# EAGLE design motor (EAGLE 8.7.0)
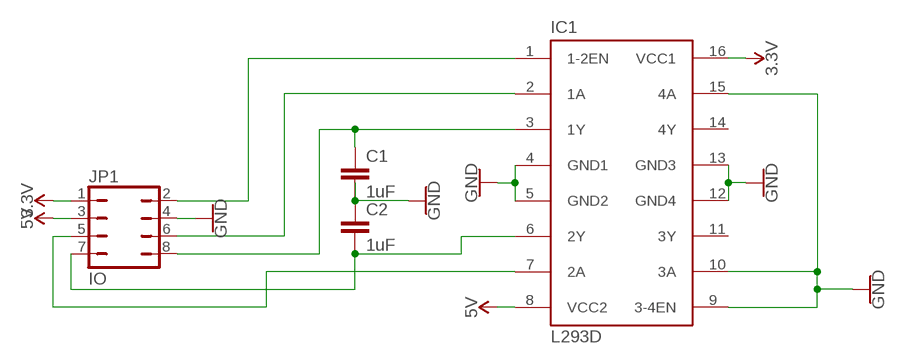
[diagram p0: schematic, sheet 1]

## Parts
C1  1uF  0.1UF-KIT-EZ-50V-20%  [CAP-PTH-SMALL-KIT]
C2  1uF  0.1UF-KIT-EZ-50V-20%  [CAP-PTH-SMALL-KIT]
IC1  L293D  [DIL16]
JP1  IO  JP4Q  [JP4Q]

## Nets
3.3V: IC1.16(VCC1) JP1.1
5V: IC1.8(VCC2) JP1.3
GND: C1.2 C2.1 IC1.4(GND1) IC1.5(GND2) IC1.9(3-4EN) IC1.10(3A) IC1.12(GND4) IC1.13(GND3) IC1.15(4A) JP1.4
N$1: C1.1 IC1.3(1Y) JP1.8
N$2: C2.2 IC1.6(2Y) JP1.7
N$4: IC1.1(1-2EN) JP1.2
N$5: IC1.2(1A) JP1.6
N$6: IC1.7(2A) JP1.5
Unconnected: IC1.11(3Y) IC1.14(4Y)

## Library data of the parts
C1 C2 = SparkFun-Capacitors:0.1UF: 0.1µF ceramic capacitors A capacitor is a passive two-terminal electrical component used to store electrical energy temporarily in an electric field.; PROD_ID: CAP-08370; VALUE: 0.1uF
IC1 = st-microelectronics:L293D: PUSH-PULL 4 CHANNEL DRIVER; MPN: L293D; OC_FARNELL: 9589619; OC_NEWARK: 56P8249
JP1 = jumper:JP4Q: JUMPER

## Net classes
0 default: width 0.635 mm, clearance 0.205 mm

## Board
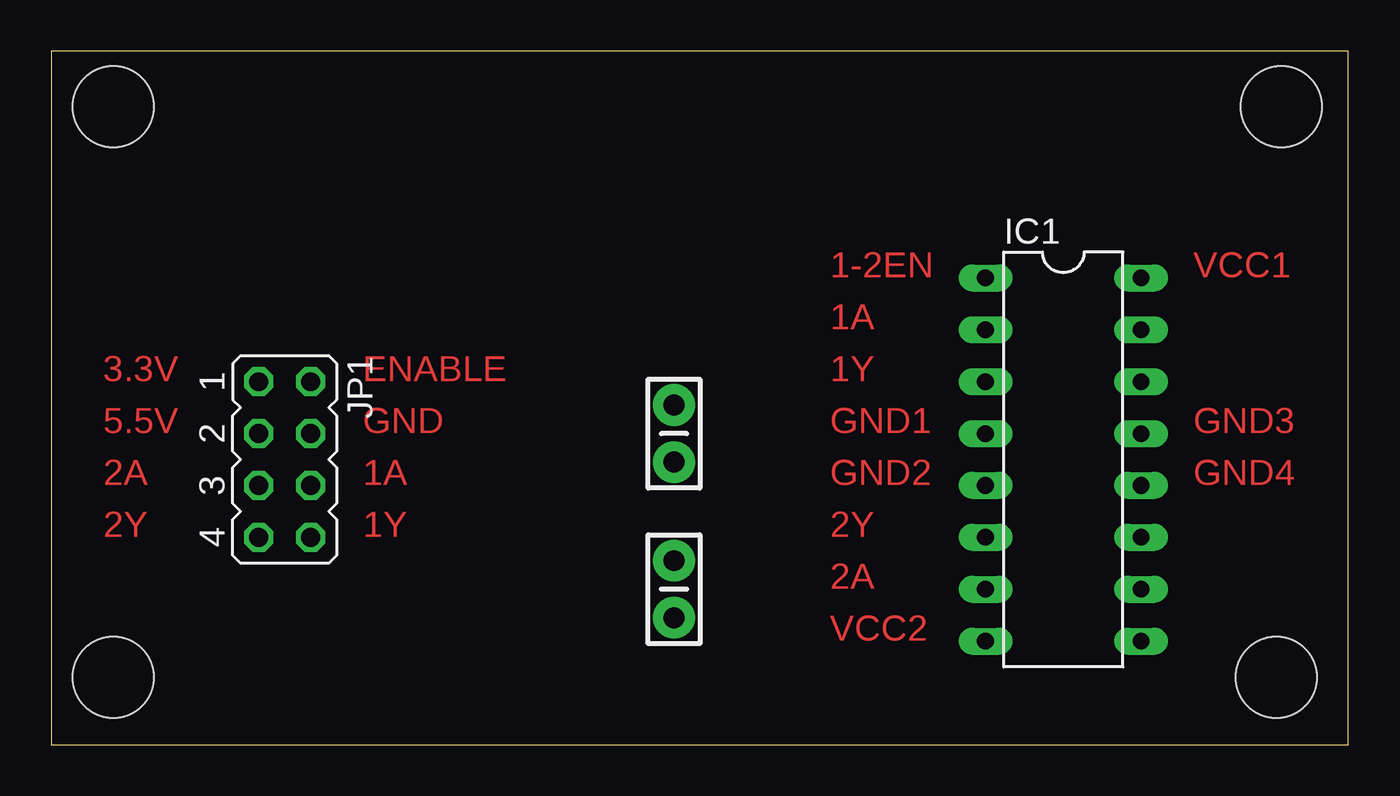
[diagram p1: board, top side]
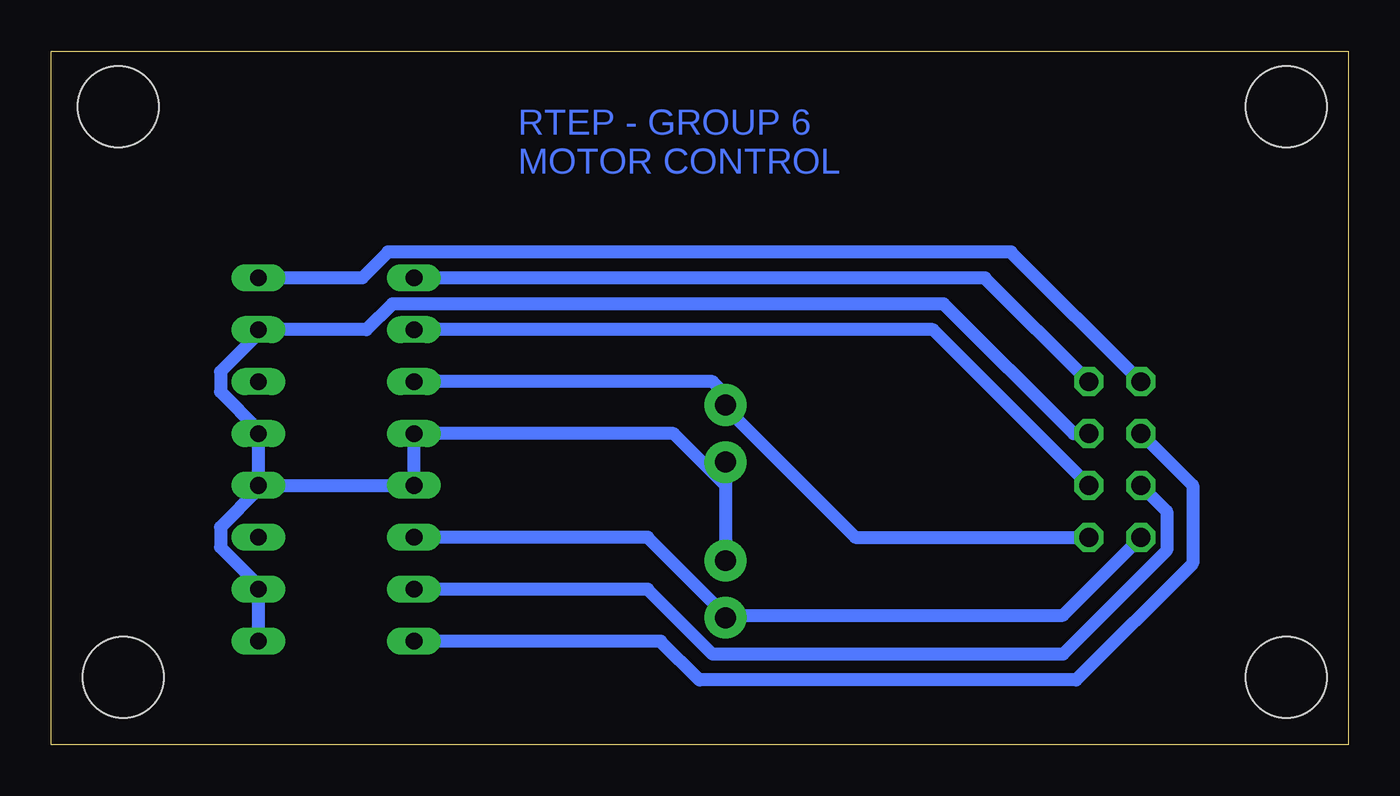
[diagram p2: board, bottom side, seen from below]

Size 63.48 x 33.96 mm. Coordinates in mm from the lower left corner, seen from the top.
Outline: 0,0 63.48,0 63.48,33.96 0,33.96 0,0
Copper layers (1*16): Top 0.035mm / dielectric 1.5mm / Bottom 0.035mm
Design rules "default *": minimum track width 25mil, minimum drill 0.35mm, track to track 25mil, track to pad 6mil, pad to pad 6mil, via to via 6mil, smd to smd 6mil, copper to edge 100mil, drill to drill 6mil, minimum pad ring 10mil, minimum via ring 8mil, stop-mask expansion 4mil, vias tented up to drill 0mil, thermal gap 10mil
Holes 3.96 mm at 3.05,31.24 60.2,31.24 59.94,3.3 3.05,3.3

### Footprints (pad centres in the part's own frame; a part is rotated, then mirrored left to right if it is on the bottom)
CAP-PTH-SMALL-KIT = drill 1.016 pad 2.032: 1 -1.397,0; 2 1.397,0
DIL16 = drill 0.813 long: 1 -8.89,-3.81; 2 -6.35,-3.81; 3 -3.81,-3.81; 4 -1.27,-3.81; 5 1.27,-3.81; 6 3.81,-3.81; 7 6.35,-3.81; 8 8.89,-3.81; 9 8.89,3.81; 10 6.35,3.81; 11 3.81,3.81; 12 1.27,3.81; 13 -1.27,3.81; 14 -3.81,3.81; 15 -6.35,3.81; 16 -8.89,3.81
JP4Q = drill 0.914 octagon: 1 -3.81,-1.27; 2 -3.81,1.27; 3 -1.27,-1.27; 4 -1.27,1.27; 5 1.27,-1.27; 6 1.27,1.27; 7 3.81,-1.27; 8 3.81,1.27

### Placement (x,y rotation side)
C1  30.48,15.24 270 top
C2  30.48,7.62 270 top
IC1  49.53,13.97 270 top
JP1  11.43,13.97 270 top

### Tracks (layer width: path | path; a pad name or v marks a point on that pad's centre or on a via)
3.3V
  Bottom 0.635: IC1.16 48.26,22.86 46.99,24.13 16.51,24.13 JP1.1
5V
  Bottom 0.635: IC1.8 33.66,5.08 31.75,3.17 13.34,3.17 7.62,8.89 7.62,12.7 JP1.3
GND
  Bottom 0.635: 30.48,12.7 C1.2 30.48,13.97 | 30.48,12.7 C2.1 | IC1.12 IC1.13 53.34,15.45 55.18,17.29 55.18,18.27 53.34,20.11 IC1.15 48.05,20.32 46.78,21.59 19.79,21.59 13.44,15.24 JP1.4 | IC1.12 IC1.5 IC1.4 33.02,15.24 30.48,12.7 | IC1.9 IC1.10 53.34,7.83 55.18,9.67 55.18,10.65 53.34,12.49 IC1.12
N$1
  Bottom 0.635: IC1.3 31.12,17.78 30.48,17.14 C1.1 30.48,16.51 24.13,10.16 JP1.8
N$2
  Bottom 0.635: IC1.6 34.29,10.16 30.48,6.35 | JP1.7 13.97,6.35 30.48,6.35 | 30.48,6.35 C2.2
N$4
  Bottom 0.635: IC1.1 17.78,22.86 JP1.2
N$5
  Bottom 0.635: IC1.2 20.32,20.32 JP1.6
N$6
  Bottom 0.635: IC1.7 34.29,7.62 31.12,4.45 13.97,4.45 8.89,9.52 8.89,11.43 JP1.5

### Text on the board
Top: 1-2EN | VCC1 | 1A | 3.3V | ENABLE | 1Y | 5.5V | GND | GND1 | GND3 | 2A | 1A | GND2 | GND4 | 2Y | 1Y | 2Y | 2A | VCC2
Bottom: RTEP - GROUP 6 / MOTOR CONTROL